# Altium schematic sheet TopSheet.SchDoc: Icarus Flight Computer
size A; DrawnBy: J. Sullivan; Organization: ORGANIZATION; Address1: ADDRESS 1; Address2: ADDRESS 2; Address3: ADDRESS 3; Address4: ADDRESS 4; Revision: -; SheetNumber: 2; SheetTotal: 13; ENG_APP_DATE: 07/28/22; DSN_APP_DATE: --/--/--; CHK_APP_DATE: --/--/--
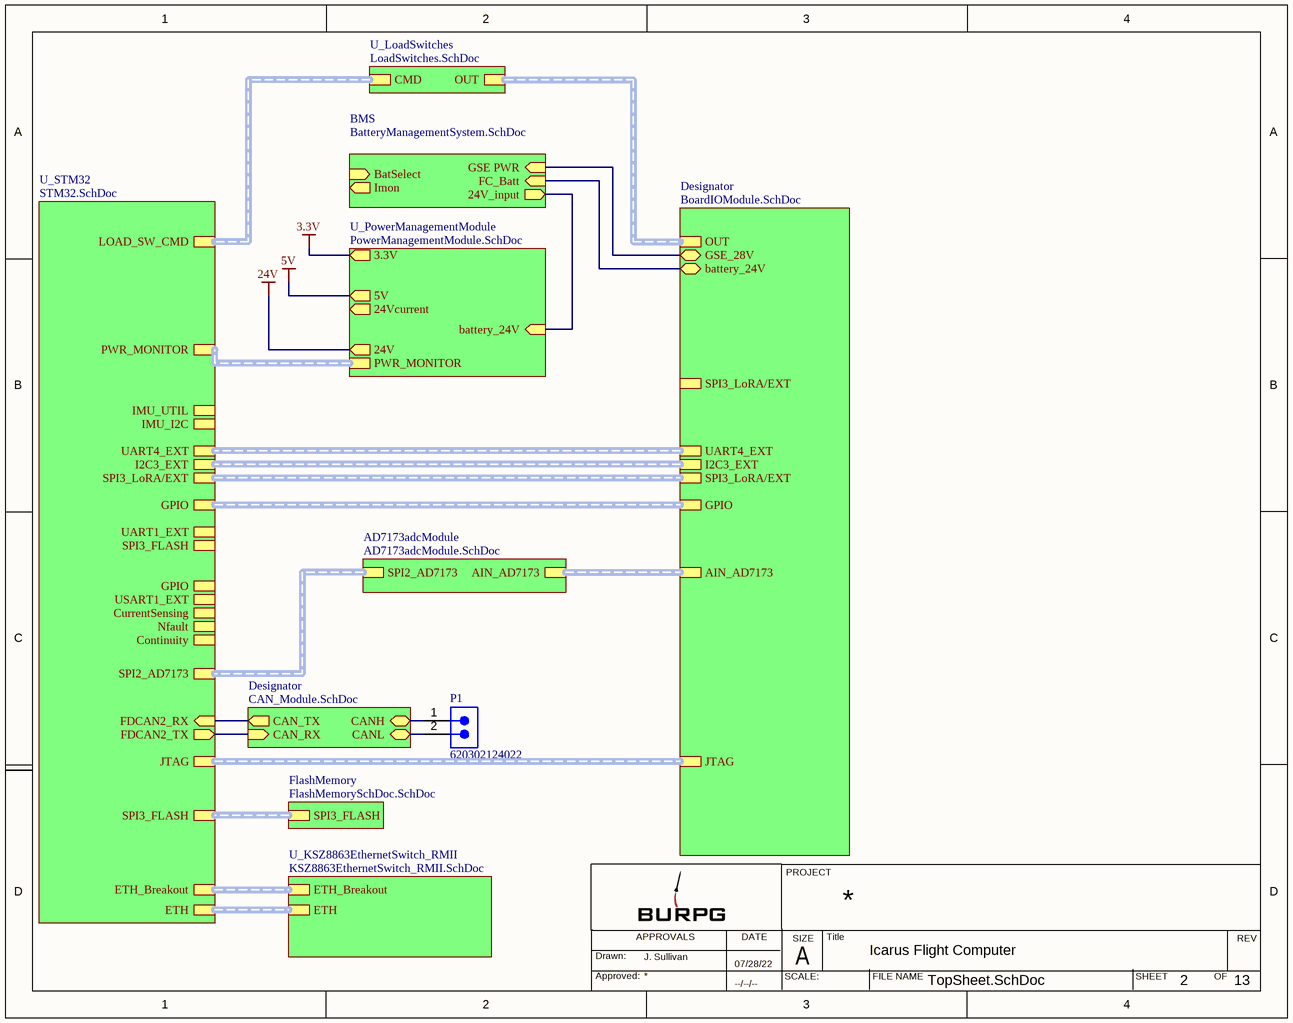
[diagram p0: TopSheet.SchDoc]

## Parts
P1  620302124022  [620302124022]

## Sub-sheets
AD7173adcModule = AD7173adcModule.SchDoc: SPI2_AD7173 (harness SPI), AIN_AD7173 (harness AIN_AD7173)
BMS = BatteryManagementSystem.SchDoc: GSE PWR (in), 24V_input (out), FC_Batt (in), BatSelect (in), Imon (out)
Designator = BoardIOModule.SchDoc: OUT (harness LOAD_SW_OUT), I2C3_EXT (harness I2C), UART4_EXT (harness UART), AIN_AD7173 (harness AIN_AD7173), SPI3_LoRA/EXT (harness SPI), JTAG (harness JTAG), GPIO, battery_24V (bidir), GSE_28V (bidir), SPI3_LoRA/EXT (harness SPI_EXT)
Designator = CAN_Module.SchDoc: CANH (bidir), CANL (bidir), CAN_RX (in), CAN_TX (out)
FlashMemory = FlashMemorySchDoc.SchDoc: SPI3_FLASH (harness LOAD_SW)
U_KSZ8863EthernetSwitch_RMII = KSZ8863EthernetSwitch_RMII.SchDoc: ETH (harness ETH), ETH_Breakout (harness SPI_ENC28J60)
U_LoadSwitches = LoadSwitches.SchDoc: CMD (harness LOAD_SW_CMD), OUT (harness LOAD_SW_OUT)
U_PowerManagementModule = PowerManagementModule.SchDoc: battery_24V (in), 24V (out), 3.3V (out), PWR_MONITOR (harness PWR_MONITOR), 24Vcurrent (out), 5V (out)
U_STM32 = STM32.SchDoc: JTAG (harness JTAG), PWR_MONITOR (harness PWR_MONITOR), UART4_EXT (harness UART), SPI3_FLASH (harness SPI), SPI2_AD7173 (harness SPI), LOAD_SW_CMD (harness LOAD_SW), IMU_I2C (harness I2C), I2C3_EXT (harness I2C), SPI3_LoRA/EXT (harness SPI), IMU_UTIL (harness IMUs), GPIO (harness *), UART1_EXT (harness UART4), SPI3_FLASH (harness SPI_FLASH), GPIO (harness GPIO), USART1_EXT (harness UART8), CurrentSensing (harness LOAD_Isense), Nfault (harness Nf), Continuity (harness Continuity), FDCAN2_RX (in), FDCAN2_TX (out), ETH (harness ETH), ETH_Breakout (harness SPI_ENC28J60)

## Nets
3.3V: sheet U_PowerManagementModule/3.3V
5V: sheet U_PowerManagementModule/5V
24V: sheet U_PowerManagementModule/24V
NetP1_1: P1.1 ; sheet Designator/CANH
NetP1_2: P1.2 ; sheet Designator/CANL
(unnamed): sheet U_STM32/FDCAN2_RX, sheet Designator/CAN_TX
(unnamed): sheet U_STM32/FDCAN2_TX, sheet Designator/CAN_RX
(unnamed): sheet U_PowerManagementModule/battery_24V, sheet BMS/24V_input
(unnamed): sheet Designator/battery_24V, sheet BMS/FC_Batt
(unnamed): sheet Designator/GSE_28V, sheet BMS/GSE PWR

## Buses and harness runs
harness sheet AD7173adcModule/AIN_AD7173 = sheet Designator/AIN_AD7173
harness sheet AD7173adcModule/SPI2_AD7173 = sheet U_STM32/SPI2_AD7173
harness sheet Designator/GPIO = sheet U_STM32/GPIO
harness sheet Designator/I2C3_EXT = sheet U_STM32/I2C3_EXT
harness sheet Designator/JTAG = sheet U_STM32/JTAG
harness sheet Designator/OUT = sheet U_LoadSwitches/OUT
harness sheet Designator/SPI3_LoRA/EXT = sheet U_STM32/SPI3_LoRA/EXT
harness sheet Designator/UART4_EXT = sheet U_STM32/UART4_EXT
harness sheet FlashMemory/SPI3_FLASH = sheet U_STM32/SPI3_FLASH
harness sheet U_KSZ8863EthernetSwitch_RMII/ETH = sheet U_STM32/ETH
harness sheet U_KSZ8863EthernetSwitch_RMII/ETH_Breakout = sheet U_STM32/ETH_Breakout
harness sheet U_LoadSwitches/CMD = sheet U_STM32/LOAD_SW_CMD
harness sheet U_PowerManagementModule/PWR_MONITOR = sheet U_STM32/PWR_MONITOR

## Notes on the sheet
- PROJECT
- Drawn:
- Approved:
- APPROVALS
- DATE
- SCALE:
- SIZE
- A
- Title
- FILE NAME
- SHEET
- OF
- REV

## Library data of the parts
P1 = CMP-1502-00660-2: NexarPartId: 18818242; Insulation: Insulated; Connector Type: Male Pin; Pitch: 2mm; Insulation Resistance: 1GΩ; Gender: Male; Voltage Rating: 125V; Number of Positions: 2; Contact Resistance: 20mΩ; Operating Supply Voltage: 100V; Current Rating: 2A; Contact Material: Copper; Number of Rows: 1; Flammability Rating: UL94 V-0; Housing Material: Nylon; Lead Pitch: 2mm; Orientation: Vertical; Max Operating Temperature: 85°C; Termination: SMD/SMT; REACH SVHC: Unknown; Contact Mating Length: 3.5052mm; RoHS: Compliant; Packaging: Tape and Reel; Number of Contacts: 2; Height: 6.6mm; Mount: Surface Mount; Number of Pins: 2; Contact Gender: Male; Min Operating Temperature: -40°C; Length: 5mm; Width: 7.9mm; Contact Plating: Tin; Color: Beige, White